# Altium schematic sheet ADC.SchDoc: {Наименование}
size 420 x 297 mm; DocumentNumber: НРДЦ.ХХХХХХ.ХХХ ХХ; SheetNumber: {}; SheetTotal: {}; PageSetup: Record=PageOptions|CenterHorizontal=False|CenterVertical=False|PrintScale=0.95|XCorrection=0.00|YCorrection=0.00|PrintKind=1|BorderSize=5000000|LeftOffset=0|BottomOffset=0|Orientation=1|PaperLength=1000|PaperWidth=1000|Scale=100|PaperSource=15|PrintQuality=600|MediaType=1|DitherType=10|PaperKind=A4|PrintScaleMode=1; Rule: PcbType=ProtelPcb
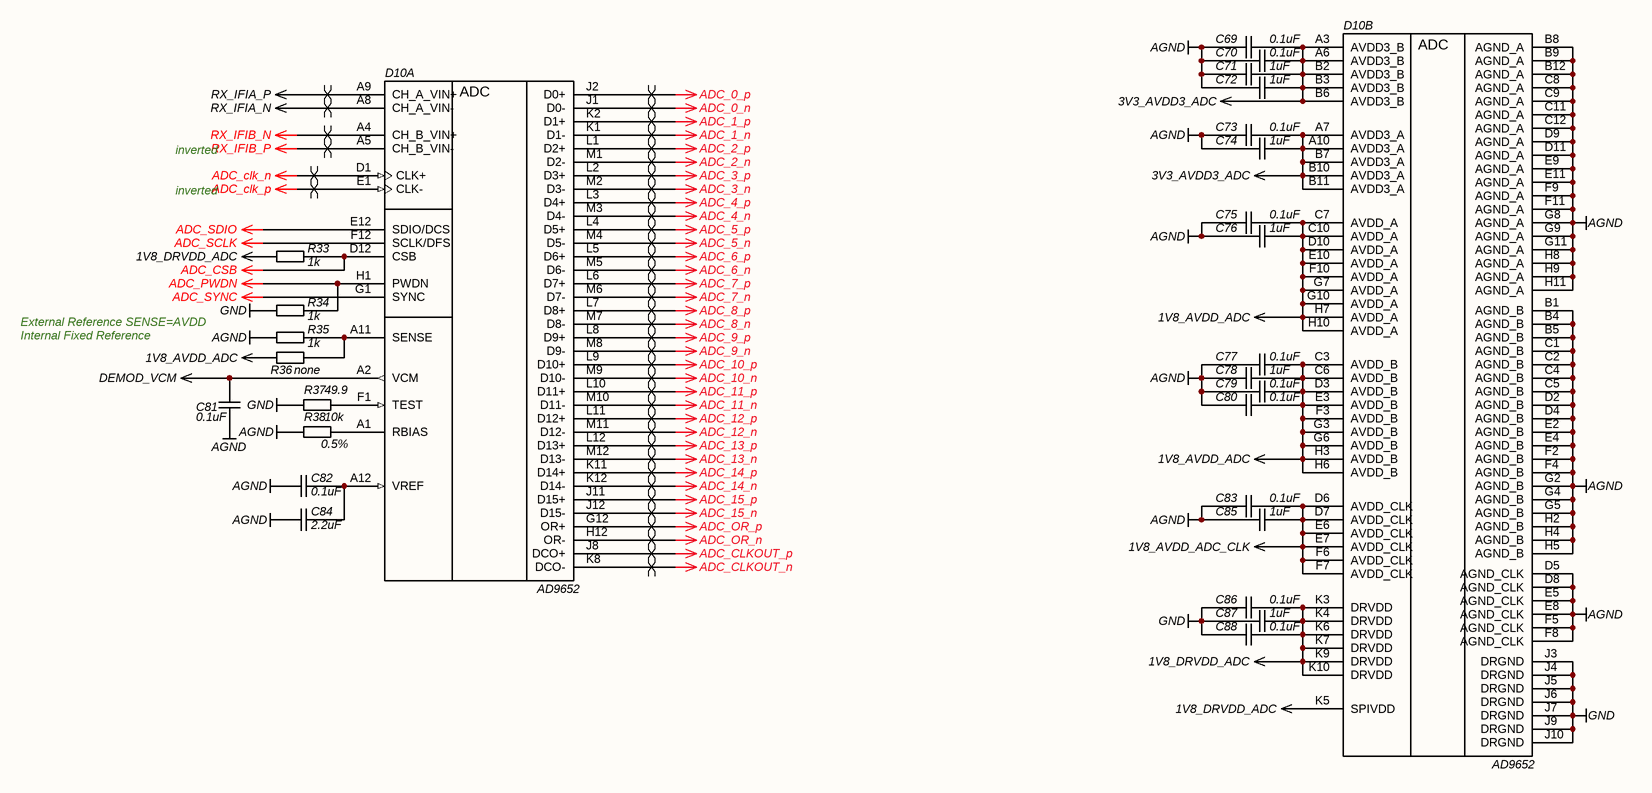
[diagram p0: ADC.SchDoc]

## Parts
C69  value 0.1uF  [C0402]  (hidden comment: CAP)
C70  value 0.1uF  [C0402]  (hidden comment: CAP)
C71  value 1uF  [C0402]  (hidden comment: CAP)
C72  value 1uF  [C0402]  (hidden comment: CAP)
C73  value 0.1uF  [C0402]  (hidden comment: CAP)
C74  value 1uF  [C0402]  (hidden comment: CAP)
C75  value 0.1uF  [C0402]  (hidden comment: CAP)
C76  value 1uF  [C0402]  (hidden comment: CAP)
C77  value 0.1uF  [C0402]  (hidden comment: CAP)
C78  value 1uF  [C0402]  (hidden comment: CAP)
C79  value 0.1uF  [C0402]  (hidden comment: CAP)
C80  value 0.1uF  [C0402]  (hidden comment: CAP)
C81  value 0.1uF  [C0402]  (hidden comment: CAP)
C82  value 0.1uF  [C0402]  (hidden comment: CAP)
C83  value 0.1uF  [C0402]  (hidden comment: CAP)
C84  value 2.2uF  [C0603]  (hidden comment: CAP)
C85  value 1uF  [C0402]  (hidden comment: CAP)
C86  value 0.1uF  [C0402]  (hidden comment: CAP)
C87  value 1uF  [C0402]  (hidden comment: CAP)
C88  value 0.1uF  [C0402]  (hidden comment: CAP)
D10  AD9652  [BGA144x12]  (parts A,B of 2)
R33  value 1k  [R0402]  (hidden comment: RES)
R34  value 1k  [R0402]  (hidden comment: RES)
R35  value 1k  [R0402]  (hidden comment: RES)
R36  value none  [R0402]  (hidden comment: RES)
R37  value 49.9  [R0402]  (hidden comment: RES)
R38  value 10k  Tolerance: 0.5%  [R0402]  (hidden comment: RES)

## Nets
1V8_AVDD_ADC: C75.2 C76.2 C77.2 C78.2 C79.2 C80.2 D10.C3(AVDD_B) D10.C6(AVDD_B) D10.C7(AVDD_A) D10.C10(AVDD_A) D10.D3(AVDD_B) D10.D10(AVDD_A) D10.E3(AVDD_B) D10.E10(AVDD_A) D10.F3(AVDD_B) D10.F10(AVDD_A) D10.G3(AVDD_B) D10.G6(AVDD_B) D10.G7(AVDD_A) D10.G10(AVDD_A) D10.H3(AVDD_B) D10.H6(AVDD_B) D10.H7(AVDD_A) D10.H10(AVDD_A) R36.2
1V8_AVDD_ADC_CLK: C83.2 C85.2 D10.D6(AVDD_CLK) D10.D7(AVDD_CLK) D10.E6(AVDD_CLK) D10.E7(AVDD_CLK) D10.F6(AVDD_CLK) D10.F7(AVDD_CLK)
1V8_DRVDD_ADC: C86.2 C87.2 C88.2 D10.K3(DRVDD) D10.K4(DRVDD) D10.K5(SPIVDD) D10.K6(DRVDD) D10.K7(DRVDD) D10.K9(DRVDD) D10.K10(DRVDD) R33.2
3V3_AVDD3_ADC: C69.2 C70.2 C71.2 C72.2 C73.2 C74.2 D10.A3(AVDD3_B) D10.A6(AVDD3_B) D10.A7(AVDD3_A) D10.A10(AVDD3_A) D10.B2(AVDD3_B) D10.B3(AVDD3_B) D10.B6(AVDD3_B) D10.B7(AVDD3_A) D10.B10(AVDD3_A) D10.B11(AVDD3_A)
ADC_0_n: D10.J1(D0-)
ADC_0_p: D10.J2(D0+)
ADC_1_n: D10.K1(D1-)
ADC_1_p: D10.K2(D1+)
ADC_2_n: D10.M1(D2-)
ADC_2_p: D10.L1(D2+)
ADC_3_n: D10.M2(D3-)
ADC_3_p: D10.L2(D3+)
ADC_4_n: D10.M3(D4-)
ADC_4_p: D10.L3(D4+)
ADC_5_n: D10.M4(D5-)
ADC_5_p: D10.L4(D5+)
ADC_6_n: D10.M5(D6-)
ADC_6_p: D10.L5(D6+)
ADC_7_n: D10.M6(D7-)
ADC_7_p: D10.L6(D7+)
ADC_8_n: D10.M7(D8-)
ADC_8_p: D10.L7(D8+)
ADC_9_n: D10.M8(D9-)
ADC_9_p: D10.L8(D9+)
ADC_10_n: D10.M9(D10-)
ADC_10_p: D10.L9(D10+)
ADC_11_n: D10.M10(D11-)
ADC_11_p: D10.L10(D11+)
ADC_12_n: D10.M11(D12-)
ADC_12_p: D10.L11(D12+)
ADC_13_n: D10.M12(D13-)
ADC_13_p: D10.L12(D13+)
ADC_14_n: D10.K12(D14-)
ADC_14_p: D10.K11(D14+)
ADC_15_n: D10.J12(D15-)
ADC_15_p: D10.J11(D15+)
ADC_clk_n: D10.D1(CLK+)
ADC_clk_p: D10.E1(CLK-)
ADC_CLKOUT_n: D10.K8(DCO-)
ADC_CLKOUT_p: D10.J8(DCO+)
ADC_CSB: D10.D12(CSB) R33.1
ADC_OR_n: D10.H12(OR-)
ADC_OR_p: D10.G12(OR+)
ADC_PWDN: D10.H1(PWDN) R34.1
ADC_SCLK: D10.F12(SCLK/DFS)
ADC_SDIO: D10.E12(SDIO/DCS)
ADC_SYNC: D10.G1(SYNC)
AGND: C69.1 C70.1 C71.1 C72.1 C73.1 C74.1 C75.1 C76.1 C77.1 C78.1 C79.1 C80.1 C81.1 C82.1 C83.1 C84.2 C85.1 D10.B1(AGND_B) D10.B4(AGND_B) D10.B5(AGND_B) D10.B8(AGND_A) D10.B9(AGND_A) D10.B12(AGND_A) D10.C1(AGND_B) D10.C2(AGND_B) D10.C4(AGND_B) D10.C5(AGND_B) D10.C8(AGND_A) D10.C9(AGND_A) D10.C11(AGND_A) D10.C12(AGND_A) D10.D2(AGND_B) D10.D4(AGND_B) D10.D5(AGND_CLK) D10.D8(AGND_CLK) D10.D9(AGND_A) D10.D11(AGND_A) D10.E2(AGND_B) D10.E4(AGND_B) D10.E5(AGND_CLK) D10.E8(AGND_CLK) D10.E9(AGND_A) D10.E11(AGND_A) D10.F2(AGND_B) D10.F4(AGND_B) D10.F5(AGND_CLK) D10.F8(AGND_CLK) D10.F9(AGND_A) D10.F11(AGND_A) D10.G2(AGND_B) D10.G4(AGND_B) D10.G5(AGND_B) D10.G8(AGND_A) D10.G9(AGND_A) D10.G11(AGND_A) D10.H2(AGND_B) D10.H4(AGND_B) D10.H5(AGND_B) D10.H8(AGND_A) D10.H9(AGND_A) D10.H11(AGND_A) R35.2 R38.2
DEMOD_VCM: C81.2 D10.A2(VCM)
GND: C86.1 C87.1 C88.1 D10.J3(DRGND) D10.J4(DRGND) D10.J5(DRGND) D10.J6(DRGND) D10.J7(DRGND) D10.J9(DRGND) D10.J10(DRGND) R34.2 R37.1
RX_IFIA_N: D10.A8(CH_A_VIN-)
RX_IFIA_P: D10.A9(CH_A_VIN+)
RX_IFIB_N: D10.A4(CH_B_VIN+)
RX_IFIB_P: D10.A5(CH_B_VIN-)
NetC82_2: C82.2 C84.1 D10.A12(VREF)
NetD10_A1: D10.A1(RBIAS) R38.1
NetD10_A11: D10.A11(SENSE) R35.1 R36.1
NetD10_F1: D10.F1(TEST) R37.2

## Layout directives
differential pair: ADC_0_n, ADC_0_p, ADC_1_n, ADC_1_p, ADC_2_n, ADC_2_p, ADC_3_n, ADC_3_p, ADC_4_n, ADC_4_p, ADC_5_n, ADC_5_p, ADC_6_n, ADC_6_p, ADC_7_n, ADC_7_p, ADC_8_n, ADC_8_p, ADC_9_n, ADC_9_p, ADC_10_n, ADC_10_p, ADC_11_n, ADC_11_p, ADC_12_n, ADC_12_p, ADC_13_n, ADC_13_p, ADC_14_n, ADC_14_p, ADC_15_n, ADC_15_p, ADC_clk_n, ADC_clk_p, ADC_CLKOUT_n, ADC_CLKOUT_p, ADC_OR_n, ADC_OR_p, RX_IFIA_N, RX_IFIA_P, RX_IFIB_N, RX_IFIB_P

## Notes on the sheet
- inverted
- External Reference SENSE=AVDD
  Internal Fixed Reference SENSE=GND
- Подп. и дата
- Инв. № дубл.
- Взам. инв. №
- Инв. № подл.
- Лист
- Изм.
- № докум.
- Подп.
- Дата
- Копировал
- Формат А3

## Library data of the parts
C69 C70 C73 C75 C77 C79 C80 C83 C86 C88 = CAP: SMD Capacitor; Manufacturer: Murata; Material: X7R; Tolerance: 10%; Voltage: 16V; Type: Ceramic Capacitor; P/N: GRM155R71C104KA88J
C71 C72 C74 C76 C78 C85 C87 = CAP: SMD Capacitor; Manufacturer: Murata; Material: X7R; Tolerance: 10%; Voltage: 6.3V; Type: Ceramic Capacitor; P/N: GRM155R70J105KA12J
C81 C82 = CAP: SMD Capacitor; Manufacturer: Murata; Material: X7R; Tolerance: 10%; Voltage: 10V; Type: Ceramic Capacitor; P/N: GRM155R71A104KA01J
C84 = CAP: SMD Capacitor; Manufacturer: Murata; Material: X7R; Tolerance: 10%; Voltage: 10V; Type: Ceramic Capacitor; P/N: GRM188R71A225KE15D
D10 = AD9652: Dual, 16-bit analog-to-digital converter (ADC) / with sampling speeds of up to 310 MSPS; Manufacturer: Analog Devices; P/N: AD9652BBCZ-310; Name: AD9652; Sampling Frequency: 310 MSPS; Type: ADC; Supplier 1: Digi-Key; Supplier Part Number 1: AD9652BBCZ-310-ND
R33-R35 = RES: SMD Resistor; Manufacturer: Panasonic Electronic Components; Name: Chip SMD Resistor; Power: 0.062 Wt; Tolerance: 5%; P/N: ERJ-2GEJ102X; Temperature Range: -55…155°C
R36 = RES: SMD Resistor; Manufacturer: Panasonic Electronic Components; Name: Chip SMD Resistor; Power: 0.062 Wt; P/N: ERJ-2GE0R00X; Temperature Range: -55…155°C
R37 = RES: SMD Resistor; Manufacturer: Panasonic Electronic Components; Name: Chip SMD Resistor; Power: 0.063 Wt; Tolerance: 0.5%; P/N: ERJ-2RKD49R9X; Temperature Range: -55…155°C
R38 = RES: SMD Resistor; Manufacturer: Panasonic Electronic Components; Name: Chip SMD Resistor; Power: 0.063 Wt; P/N: ERA-2AED103X; Temperature Range: -55…155°C